# Altium schematic sheet Power_Supply.SchDoc
size A4
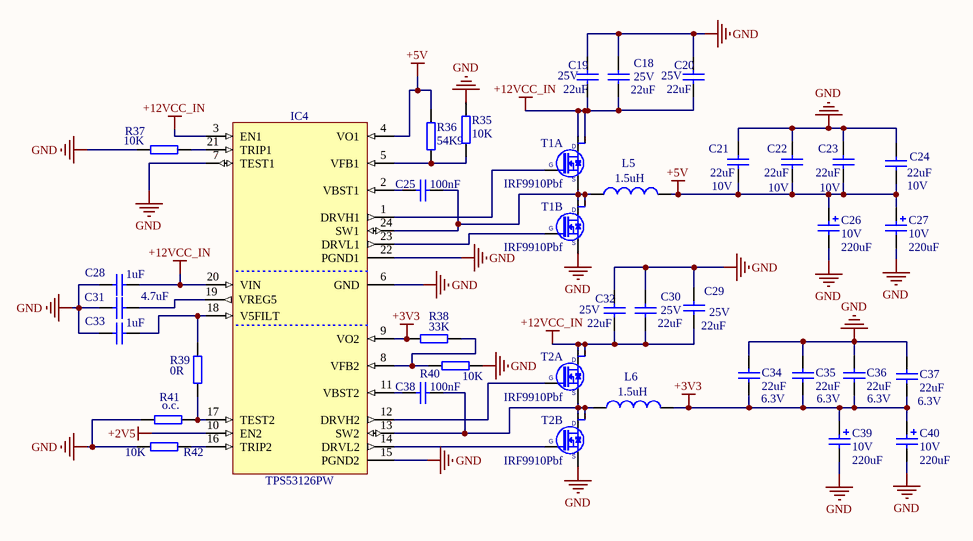
[diagram p0: Power_Supply.SchDoc]

## Parts
C18  value 22uF  Voltage: 25V  [CC3216-1206]  (hidden comment: 22uF 25V)
C19  value 22uF  Voltage: 25V  [CC3216-1206]  (hidden comment: 22uF 25V)
C20  value 22uF  Voltage: 25V  [CC3216-1206]  (hidden comment: 22uF 25V)
C21  value 22uF  Voltage: 10V  [CC2012-0805]  (hidden comment: 22uF 10V)
C22  value 22uF  Voltage: 10V  [CC2012-0805]  (hidden comment: 22uF 10V)
C23  value 22uF  Voltage: 10V  [CC2012-0805]  (hidden comment: 22uF 10V)
C24  value 22uF  Voltage: 10V  [CC2012-0805]  (hidden comment: 22uF 10V)
C25  100nF  [CC1608-0603]
C26  value 220uF  Voltage: 10V  [D]  (hidden comment: 220uF 10V)
C27  value 220uF  Voltage: 10V  [D]  (hidden comment: 220uF 10V)
C28  1uF  [CC1608-0603]
C29  value 22uF  Voltage: 25V  [CC3216-1206]  (hidden comment: 22uF 25V)
C30  value 22uF  Voltage: 25V  [CC3216-1206]  (hidden comment: 22uF 25V)
C31  4.7uF  [CC1608-0603]
C32  value 22uF  Voltage: 25V  [CC3216-1206]  (hidden comment: 22uF 25V)
C33  1uF  [CC1608-0603]
C34  Voltage: 6.3V  [CC2012-0805]  (hidden comment: 22uF)
C35  Voltage: 6.3V  [CC2012-0805]  (hidden comment: 22uF)
C36  Voltage: 6.3V  [CC2012-0805]  (hidden comment: 22uF)
C37  Voltage: 6.3V  [CC2012-0805]  (hidden comment: 22uF)
C38  100nF  [CC1608-0603]
C39  value 220uF  Voltage: 10V  [D]  (hidden comment: 220uF 10V)
C40  value 220uF  Voltage: 10V  [D]  (hidden comment: 220uF 10V)
IC4  TPS53126PW  [SOP65P640X120-24N]
L5  value 1.5uH  [IHLP2525]  (hidden comment: IHLP2525CZER1R5M01)
L6  value 1.5uH  [IHLP2525]  (hidden comment: IHLP2525CZER1R5M01)
R35  10K  [0603]
R36  54K9  [0603]
R37  10K  [0603]
R38  33K  [0603]
R39  0R  [0603]
R40  10K  [0603]
R41  o.c.  [0603]
R42  10K  [0603]
T1  IRF9910Pbf  [SOIC127P600X175-8N]  (parts A,B of 2)
T2  IRF9910Pbf  [SOIC127P600X175-8N]  (parts A,B of 2)

## Nets
+2V5: IC4.10(EN2)
+3V3: C34.2 C35.1 C36.1 C37.1 C39.1 C40.1 IC4.9(VO2) L6.2 R38.1
+5V: C21.1 C22.1 C23.1 C24.1 C26.1 C27.1 IC4.4(VO1) L5.2 R36.2
+12VCC_IN: C18.1 C19.1 C20.1 C28.2 C29.1 C30.1 C32.1 IC4.3(EN1) IC4.20(VIN) T1.5(D) T1.6(D) T2.5(D) T2.6(D)
GND: C18.2 C19.2 C20.2 C21.2 C22.2 C23.2 C24.2 C26.2 C27.2 C28.1 C29.2 C30.2 C31.2 C32.2 C33.1 C34.1 C35.2 C36.2 C37.2 C39.2 C40.2 IC4.6(GND) IC4.7(TEST1) IC4.15(PGND2) IC4.22(PGND1) R35.2 R37.2 R40.1 R41.2 R42.2 T1.1(S) T2.1(S)
NetC25_1: C25.1 IC4.24(SW1) L5.1 T1.3(S) T1.7(D) T1.8(D)
NetC25_2: C25.2 IC4.2(VBST1)
NetC31_1: C31.1 IC4.19(VREG5)
NetC33_2: C33.2 IC4.18(V5FILT) R39.1
NetC38_1: C38.1 IC4.13(SW2) L6.1 T2.3(S) T2.7(D) T2.8(D)
NetC38_2: C38.2 IC4.11(VBST2)
NetIC4_1: IC4.1(DRVH1) T1.4(G)
NetIC4_5: IC4.5(VFB1) R35.1 R36.1
NetIC4_8: IC4.8(VFB2) R38.2 R40.2
NetIC4_12: IC4.12(DRVH2) T2.4(G)
NetIC4_14: IC4.14(DRVL2) T2.2(G)
NetIC4_16: IC4.16(TRIP2) R42.1
NetIC4_17: IC4.17(TEST2) R39.2 R41.1
NetIC4_21: IC4.21(TRIP1) R37.1
NetIC4_23: IC4.23(DRVL1) T1.2(G)

## Library data of the parts
C18-C20 C29 C30 C32 = CC1206_22UF_25V_10%_X5R: Capacitor; Manufacturer1: Murata; Manufacturer1 PN: GRM31CR61E226KE15L; TC: X5R; Tolerance: ±10%; Published: 8-Jun-2000; LatestRevisionDate: 17-Jul-2002; LatestRevisionNote: Re-released for DXP Platform.; PackageReference: RAD-0.3; Publisher: Altium Limited; Distributor1: Digikey; Distributor1 PN: 490-5527-1-ND; Case: 1206
C21 C23 C24 = CC0805_22UF_16V_10%_X5R: Capacitor; Manufacturer1: TDK; Manufacturer1 PN: C2012X5R1A226K/1.25; TC: X5R; Tolerance: ±10%; Published: 8-Jun-2000; LatestRevisionDate: 17-Jul-2002; LatestRevisionNote: Re-released for DXP Platform.; PackageReference: RAD-0.3; Publisher: Altium Limited; Distributor1: Digikey; Distributor1 PN: 445-7664-1-ND; Case: 0805
C22 = CC0805_22UF_16V_10%_X5R: Capacitor; Manufacturer1: Phycomp; Manufacturer1 PN: C2012X5R1A226K/1.25; TC: X5R; Tolerance: ±10%; Published: 8-Jun-2000; LatestRevisionDate: 17-Jul-2002; LatestRevisionNote: Re-released for DXP Platform.; PackageReference: RAD-0.3; Publisher: Altium Limited; Distributor1: Digikey; Distributor1 PN: 445-7664-1-ND; Case: 0805
C25 C38 = CC0603_100NF_16V_10%_X7R: Capacitor; Manufacturer1: AVX; Manufacturer1 PN: 0603YC104KAT2A; TC: X7R; Tolerance: ±10%; Voltage: 16V; Published: 8-Jun-2000; LatestRevisionDate: 17-Jul-2002; LatestRevisionNote: Re-released for DXP Platform.; PackageReference: RAD-0.3; Publisher: Altium Limited; Distributor1: Digikey; Distributor1 PN: 478-1239-1-ND; Case: 0603; Value: 100nF
C26 C27 C39 C40 = CP2917_220UF_10V_20%_TANT: Polarized Capacitor Tantalum; Manufacturer1: Kemet; Manufacturer1 PN: T520D227M010ATE018; Tolerance: ±20%; ESR: 18mOhm; Published: 8-Jun-2000; LatestRevisionDate: 17-Jul-2002; LatestRevisionNote: Re-released for DXP Platform.; PackageReference: RB7.6-15; Publisher: Altium Limited; Case: 2917; Distributor1: Digikey; Distributor1 PN: 399-4045-1-ND; TC: Tantalum
C28 C33 = CC0603_1UF_25V_10%_X5R: Capacitor; Manufacturer1: Phycomp; Manufacturer1 PN: GRM188R61E105KA12D; TC: X5R; Tolerance: ±10%; Voltage: 25V; Published: 8-Jun-2000; LatestRevisionDate: 17-Jul-2002; LatestRevisionNote: Re-released for DXP Platform.; Publisher: Altium Limited; Distributor1: Digikey; Distributor1 PN: 490-3897-1-ND; Case: 0603; Value: 1uF
C31 = CC0603_4.7UF_10V_10%_X5R: Capacitor; Manufacturer1: TDK; Manufacturer1 PN: C1608X5R1A475K; TC: X5R; Tolerance: ±10%; Voltage: 10V; Published: 8-Jun-2000; LatestRevisionDate: 17-Jul-2002; LatestRevisionNote: Re-released for DXP Platform.; PackageReference: RAD-0.3; Publisher: Altium Limited; Distributor1: Digikey; Distributor1 PN: 445-5170-1-ND; Case: 0603; Value: 4.7uF
C34-C37 = CC0805_22UF_6.3V_20%_X5R: Capacitor; Manufacturer1: TDK; Manufacturer1 PN: C2012X5R0J226M; TC: X5R; Tolerance: ±20%; Published: 8-Jun-2000; LatestRevisionDate: 17-Jul-2002; LatestRevisionNote: Re-released for DXP Platform.; PackageReference: RAD-0.3; Publisher: Altium Limited; Distributor1: Digikey; Distributor1 PN: 445-1422-1-ND; Case: 0805; Value: 22uF
IC4 = TPS53126PW: Dual Synchronous Step-Down Controller For Low Voltage Power Rails; Manufacturer 1: TEXAS INSTRUMENTS; Table: Analog & Interface; Part Number: TPS53126PW; Component Kind: Standard; Component Type: Standard; Device: TPS53126PW; PackageDescription: SOP, 0.65mm Pitch; 24 Pin, 4.40mm W X 7.80mm L X 1.20mm H Body, IPC Medium Density; Part Description: Dual Synchronous Step-Down Controller For Low Voltage Power Rails; Manufacturer PN: TPS53126PW; Pin Count: 24; Case: QFN24; Mounted: Yes; Socket: No; SMD: Yes; ComponentHeight: 1.0mm; Author: CERN DEM JLC; HelpURL: \\cern.ch\dfs\Applications\Altium\Datasheets\TPS53126RGET.pdf; CreateDate: 2010-08-26; LatestRevisionDate: 2010-08-26; Distributor1: Digikey; Distributor1 PN: 296-24555-1-ND
L5 L6 = Inductor: Low Profile, High Current Inductor; Manufacturer: Vishay/Dale; Published: 8-Jun-2000; Revision: July-2002: Re-released for DXP Platform.; Publisher: Altium Limited; Manufacturer PN: IHLP2525CZER1R5M01; Distributor1 PN: 541-1007-1-ND; Distributor1: Digikey
R35 R37 R40 R42 = R0603_10K_±1%_0.2W_100PPM: SMD Resistor; Manufacturer1: Rohm; Manufacturer1 PN: ESR03EZPF1002; TCR: 100ppm; Power Rating: 0.2W; Tolerance: ±1%; Case: 0603; Distributor1: DigiKey; Distributor1 PN: RHM10KADCT-ND; Value: 10K
R36 = R0603_54K9_±1%_0.1W_100PPM: SMD Resistor; Manufacturer1: Panasonic; Manufacturer1 PN: ERJ-3EKF5492V; TCR: 100ppm; Power Rating: 0.1W; Tolerance: ±1%; Case: 0603; Distributor1: DigiKey; Distributor1 PN: P54.9KHCT-ND; Value: 54K9
R38 = R0603_33K_±1%_0.1W_100PPM: SMD Resistor; Manufacturer1: Panasonic; Manufacturer1 PN: ERJ-3EKF3302V; TCR: 100ppm; Power Rating: 0.1W; Tolerance: ±1%; Case: 0603; Distributor1: DigiKey; Distributor1 PN: P33.0KHCT-ND; Value: 33K
R39 = R0603_0R_0.1W_JUMPER: SMD Resistor; Manufacturer1: Yageo; Manufacturer1 PN: RC0603JR-070RL; TCR: 200ppm; Power Rating: 0.1W; Case: 0603; Distributor1: DigiKey; Distributor1 PN: 311-0.0GRCT-ND; Tolerance: -; Value: 0R
R41 = R0603_O.C.: SMD Resistor; Manufacturer1: NA; Case: 0603; Manufacturer1 PN: NA; Distributor1: NA; Distributor1 PN: NA; TCR: NA; Power Rating: NA; Tolerance: NA; Value: o.c.
T1 T2 = IRF9910Pbf: Dual SO-8 MOSFET For POL Cconverter; Part Description: 20V 10A(Q1) 20V 12A (Q2) Dual SO-8 MOSFET For POL Cconverter; Manufacturer: INTERNATIONAL RECTIFIER; Table: Transistors; Part Number: IRF9910Pbf; Component Kind: Standard; Component Type: Standard; Device: IRF9910Pbf; PackageDescription: SOIC 8, Pitch 1.27mm - Body 4x5mm, IPC Medium Density; Manufacturer Part Number: IRF9910Pbf; Pin Count: 8; Case: DO8; Mounted: Yes; Socket: No; SMD: Yes; ComponentHeight: 1.75mm; HelpURL: \\cern.ch\dfs\Applications\Altium\Datasheets\IRF9910Pbf.pdf; Author: CERN DEM JLC; CreateDate: 30/08/2010; LatestRevisionDate: 30/08/2010